# EAGLE design test-fixture-SMA (EAGLE 9.0.0)
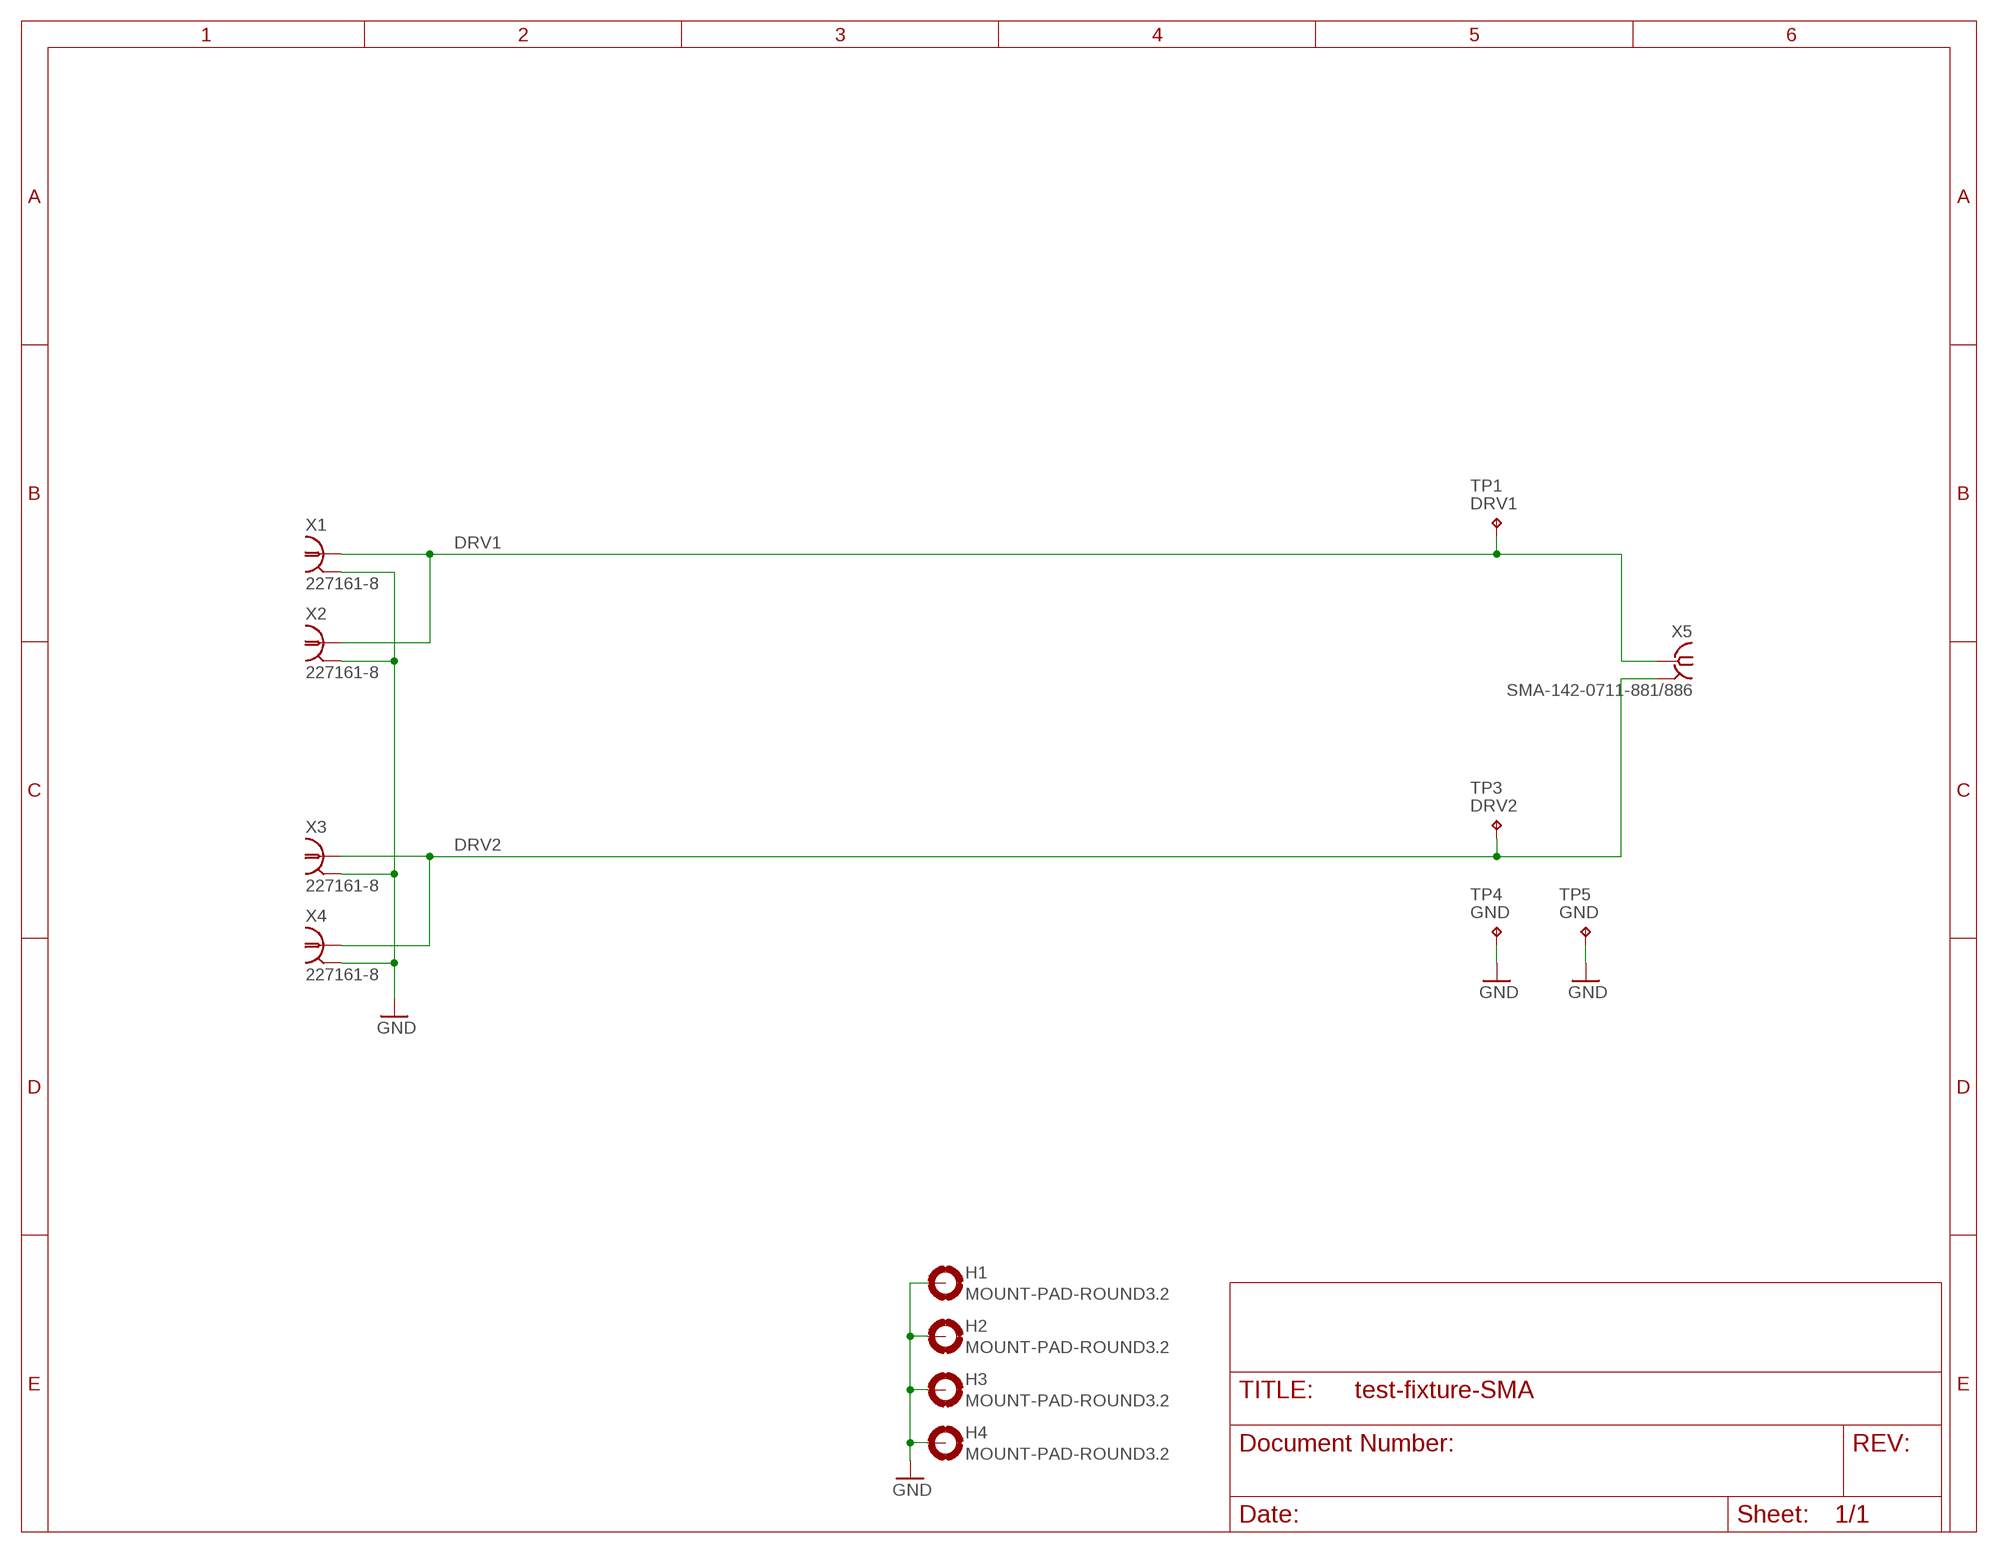
[diagram p0: schematic, sheet 1]

## Parts
H1  MOUNT-PAD-ROUND3.2  [3,2-PAD]
H2  MOUNT-PAD-ROUND3.2  [3,2-PAD]
H3  MOUNT-PAD-ROUND3.2  [3,2-PAD]
H4  MOUNT-PAD-ROUND3.2  [3,2-PAD]
TP1  DRV1  KEYSTONE_5000  [KEYSTONE_5000_MINIATURE]
TP3  DRV2  KEYSTONE_5000  [KEYSTONE_5000_MINIATURE]
TP4  GND  KEYSTONE_5000  [KEYSTONE_5000_MINIATURE]
TP5  GND  KEYSTONE_5000  [KEYSTONE_5000_MINIATURE]
X1  227161-8  [AMP_227161]
X2  227161-8  [AMP_227161]
X3  227161-8  [AMP_227161]
X4  227161-8  [AMP_227161]
X5  SMA-142-0711-881/886  [J502-ND-142-0711-881/886]

## Nets
DRV1: TP1.P$1 X1.1 X2.1 X5.1
DRV2: TP3.P$1 X3.1 X4.1 X5.G@1 X5.G@2 X5.G@3 X5.G@4
GND: H1.B3,2(MOUNT) H2.B3,2(MOUNT) H3.B3,2(MOUNT) H4.B3,2(MOUNT) TP4.P$1 TP5.P$1 X1.2 X2.2 X3.2 X4.2

## Library data of the parts
H1-H4 = holes:MOUNT-PAD-ROUND: MOUNTING PAD, round
TP1 TP3-TP5 = Kramnik's Library:KEYSTONE_5000
X1-X4 = con-coax:?227161*: JACK, RIGHT ANGLE, 50 OHM, PCB, BNC Source: amp_227161.pdf; OC_FARNELL: unknown; OC_NEWARK: unknown
X5 = con-coax:SMA-: SMA 50 Ohm End Launch Jack Receptacle - Round Contact Johnson Components Source: www.johnsoncomponents.com .. J502-ND.pdf; MF: JOHNSON COMPONENTS; MPN: 142-0711-881; OC_FARNELL: unknown; OC_NEWARK: 50B4464

## Board
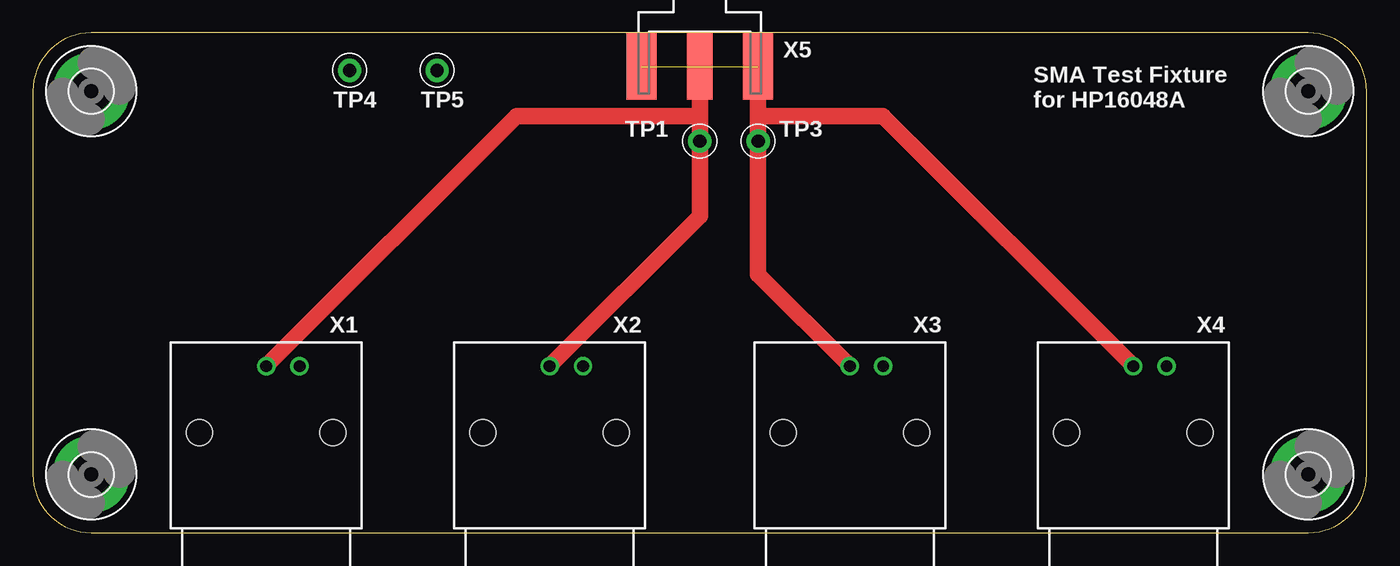
[diagram p1: board, top side]
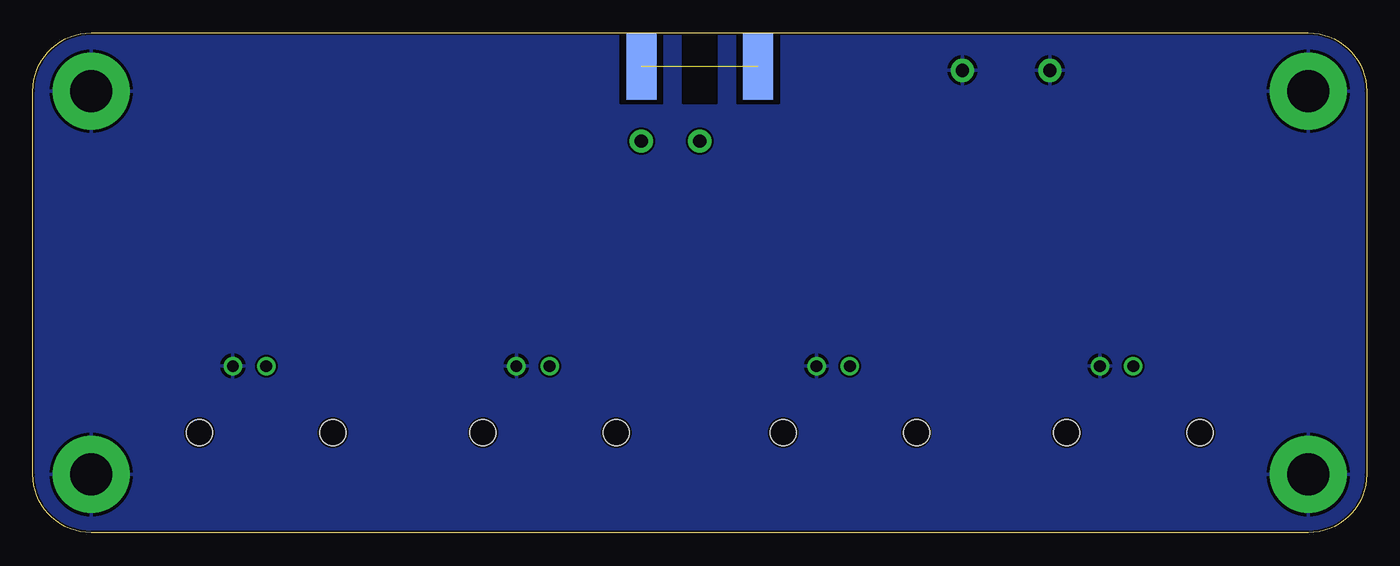
[diagram p2: board, bottom side, seen from below]

Size 101.6 x 38.1 mm. Coordinates in mm from the lower left corner, seen from the top.
Outline: 0,33.66 0,4.45 arc90 4.45,0 97.16,0 arc90 101.6,4.45 101.6,33.66 arc90 97.16,38.1 4.45,38.1 arc90 0,33.66
Copper layers (1*16): Top 0.035mm / dielectric 1.5mm / Bottom 0.035mm
Design rules "default *": minimum track width 6mil, minimum drill 0.35mm, track to track 6mil, track to pad 6mil, pad to pad 6mil, via to via 6mil, smd to smd 6mil, copper to edge 6mil, drill to drill 6mil, minimum pad ring 10mil, minimum via ring 8mil, stop-mask expansion 4mil, vias tented up to drill 0mil, thermal gap 10mil
bRestrict: area 44.8,32.7 to 56.8,38.7

### Footprints (pad centres in the part's own frame; a part is rotated, then mirrored left to right if it is on the bottom)
3,2-PAD = drill 3.2 pad 5.842: B3,2 0,0
KEYSTONE_5000_MINIATURE = drill 1.016 pad 1.778: P$1 0,0
AMP_227161 = drill 0.9 pad 1.27: 1 0,-5.08; 2 -2.54,-5.08 | hole 2: -5.08,0; 5.08,0
J502-ND-142-0711-881/886 = smd 5.08 x 1.905: 1 2.565,0 | smd 5.08 x 2.286: G@1 2.565,4.42; G@2 2.565,-4.42 | smd 5.08 x 2.286 bottom: G@3 2.565,4.42; G@4 2.565,-4.42

### Placement (x,y rotation side)
H1  4.45,4.45 0 top
H2  4.45,33.66 0 top
H3  97.16,4.45 0 top
H4  97.16,33.66 0 top
TP1  50.8,29.84 0 top
TP3  55.24,29.84 0 top
TP4  24.13,35.24 0 top
TP5  30.8,35.24 0 top
X1  17.78,7.62 180 top
X2  39.37,7.62 180 top
X3  62.23,7.62 180 top
X4  83.82,7.62 180 top
X5  50.8,38.1 270 top

### Tracks (layer width: path | path; a pad name or v marks a point on that pad's centre or on a via)
DRV1
  Top 1.27: X5.1 50.8,31.75 | 50.8,31.75 TP1.P$1 50.8,24.13 X2.1 | 50.8,31.75 36.83,31.75 X1.1
DRV2  (3 unrouted)
  Top 1.27: X5.G@3 55.24,35.51 55.24,31.75 | 55.24,31.75 TP3.P$1 55.24,19.68 X3.1 | 55.24,31.75 64.77,31.75 X4.1
GND
  pour Bottom: -0.64,38.73 102.23,38.73 102.23,-0.64 -0.64,-0.64

### Text on the board
tPlace: SMA Test Fixture / for HP16048A